# Altium schematic sheet 02_ESP12_CORE.SchDoc: ESP-12 CORE
size A4; Date: 20/11/2014; Author: HuangRui <vowstar@gmail.com>; DrawnBy: JiYaping <jyp1817@gmail.com>; Organization: WWW.NODEMCU.COM
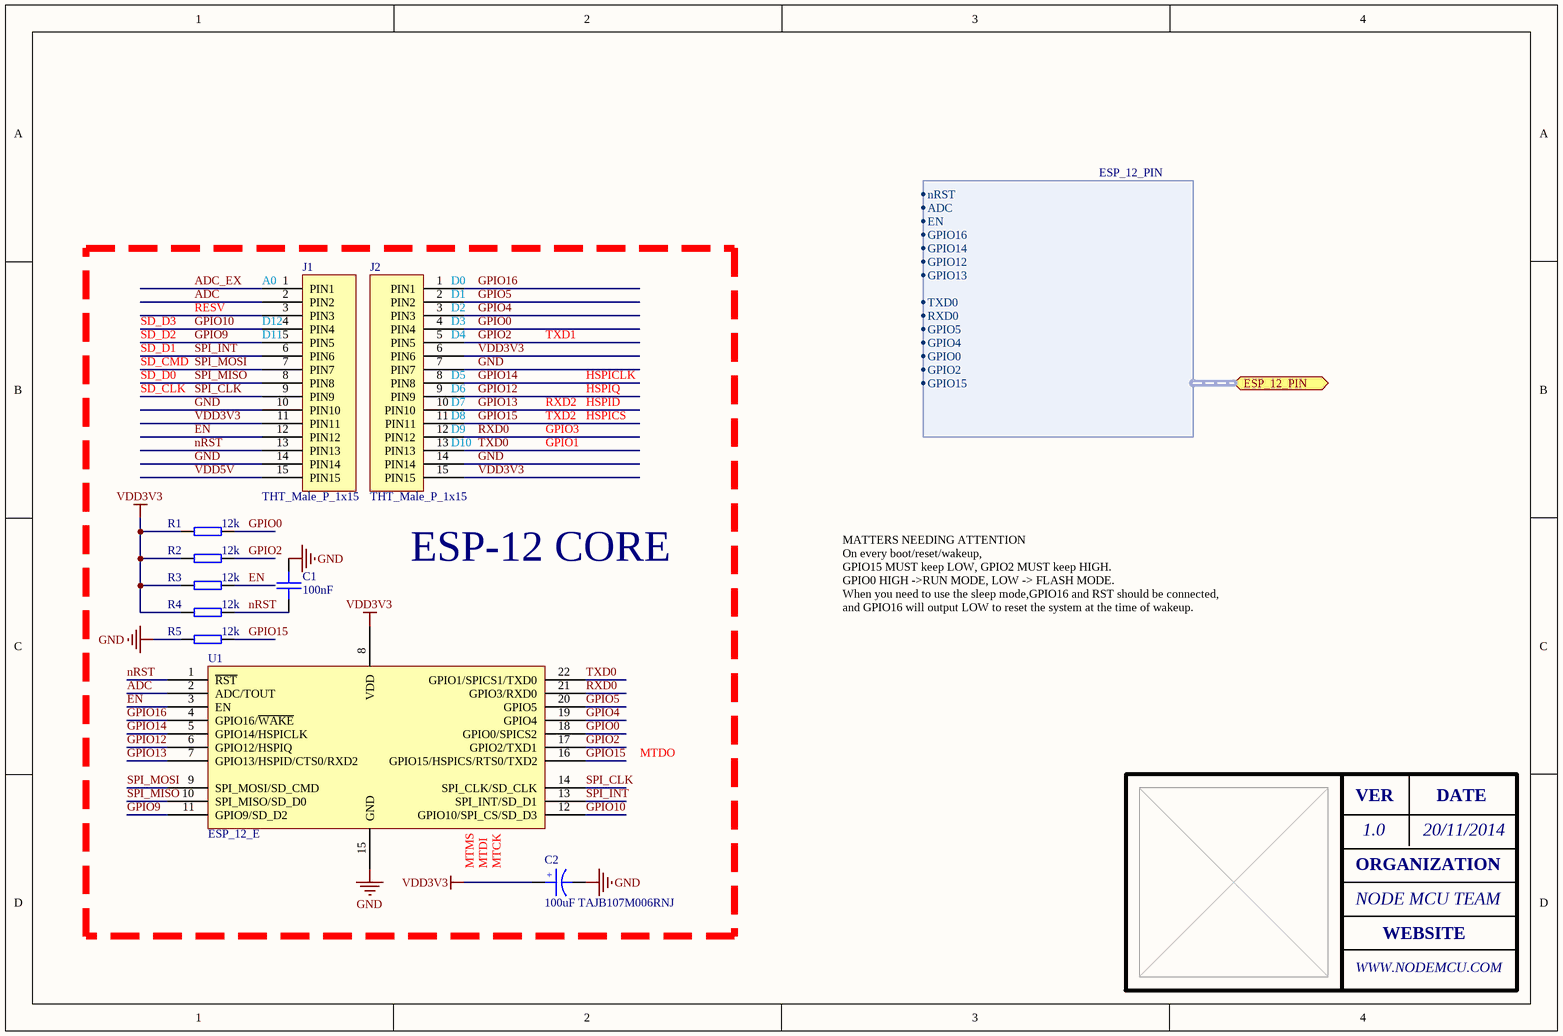
[diagram p0: 02_ESP12_CORE.SchDoc]

## Parts
C1  100nF  [SMT_C_0402]
C2  100uF TAJB107M006RNJ  [SMT_C_Tantalum_B]
J1  THT_Male_P_1x15  [THT_Male_P_1x15-2.54mm]
J2  THT_Male_P_1x15  [THT_Male_P_1x15-2.54mm]
R1  12k  [SMT_R_0402]
R2  12k  [SMT_R_0402]
R3  12k  [SMT_R_0402]
R4  12k  [SMT_R_0402]
R5  12k  [SMT_R_0402]
U1  ESP_12_E  [ESP_12_E_L]

## Ports
ESP_12_PIN (harness ESP_12_PIN)

## Harnesses
ESP_12_PIN: nRST, ADC, EN, GPIO16, GPIO12, GPIO13, GPIO14, TXD0, RXD0, GPIO4, GPIO5, GPIO0, GPIO2, GPIO15

## Nets
GND: C1.2 C2.2 J1.10(PIN10) J1.14(PIN14) J2.7(PIN7) J2.14(PIN14) R5.1 U1.15(GND)
VDD3V3: C2.1 J1.11(PIN11) J2.6(PIN6) J2.15(PIN15) R1.1 R2.1 R3.1 R4.1 U1.8(VDD)
ADC: J1.2(PIN2) U1.2(ADC/TOUT)
ADC_EX: J1.1(PIN1)
EN: J1.12(PIN12) R3.2 U1.3(EN)
GPIO0: J2.4(PIN4) R1.2 U1.18(GPIO0/SPICS2)
GPIO2: J2.5(PIN5) R2.2 U1.17(GPIO2/TXD1)
GPIO4: J2.3(PIN3) U1.19(GPIO4)
GPIO5: J2.2(PIN2) U1.20(GPIO5)
GPIO9: J1.5(PIN5) U1.11(GPIO9/SD_D2)
GPIO10: J1.4(PIN4) U1.12(GPIO10/SPI_CS/SD_D3)
GPIO12: J2.9(PIN9) U1.6(GPIO12/HSPIQ)
GPIO13: J2.10(PIN10) U1.7(GPIO13/HSPID/CTS0/RXD2)
GPIO14: J2.8(PIN8) U1.5(GPIO14/HSPICLK)
GPIO15: J2.11(PIN11) R5.2 U1.16(GPIO15/HSPICS/RTS0/TXD2)
GPIO16: J2.1(PIN1) U1.4(GPIO16/~{WAKE})
nRST: C1.1 J1.13(PIN13) R4.2 U1.1(~{RST})
RXD0: J2.12(PIN12) U1.21(GPIO3/RXD0)
SPI_CLK: J1.9(PIN9) U1.14(SPI_CLK/SD_CLK)
SPI_INT: J1.6(PIN6) U1.13(SPI_INT/SD_D1)
SPI_MISO: J1.8(PIN8) U1.10(SPI_MISO/SD_D0)
SPI_MOSI: J1.7(PIN7) U1.9(SPI_MOSI/SD_CMD)
TXD0: J2.13(PIN13) U1.22(GPIO1/SPICS1/TXD0)
VDD5V: J1.15(PIN15)

Not connected (* = marked no-connect by the designer): J1 3(PIN3)

## Notes on the sheet
- RESV
- (near J1) A0
- (near J2) D0
- (near J2) D1
- (near J2) D2
- SD_D0
- SD_CMD
- SD_D1
- SD_D3
- SD_D2
- (near J1) D12
- (near J1) D11
- (near J2) D3
- (near J2) D4
- (near J2) D5
- TXD1
- HSPICLK
- SD_CLK
- (near J2) D6
- (near J2) D7
- (near J2) D8
- (near J2) D9
- (near J2) D10
- TXD2
- RXD2
- GPIO3
- GPIO1
- HSPIQ
- HSPID
- HSPICS
- MATTERS NEEDING ATTENTION
  On every boot/reset/wakeup,
  GPIO15 MUST keep LOW, GPIO2 MUST keep HIGH.
  GPIO0 HIGH ->RUN MODE, LOW -> FLASH MODE.
  When you need to use the sleep mode,GPIO16 and RST should be connected,
  and GPIO16 will output LOW to reset the system at the time of wakeup.
- MTDO
- VER
- 1.0
- DATE
- (near U1) MTMS
- (near U1) MTDI
- (near U1) MTCK
- ORGANIZATION
- NODE MCU TEAM
- WEBSITE
- (in symbol SMT_C_Tantalum_B) +

## Library data of the parts
C1 = SMT_C_0402: Surface mount capacitor 0402
C2 = SMT_C_Tantalum_B: Capacitor, SM Tantalum; Body 3.5 x 2.8 mm (LxW typ)
J1 J2 = THT_Male_P_1x15: THT Male pin header strip 1x15
R1-R5 = SMT_R_0402: Surface mount resistor 0402
U1 = ESP_12_E: ESP-12 Wi-Fi Module by AI-Thinker; IC: ESP8266-EX; Vendor: Ai-thinker